# Altium schematic sheet DAC.SchDoc
size A3
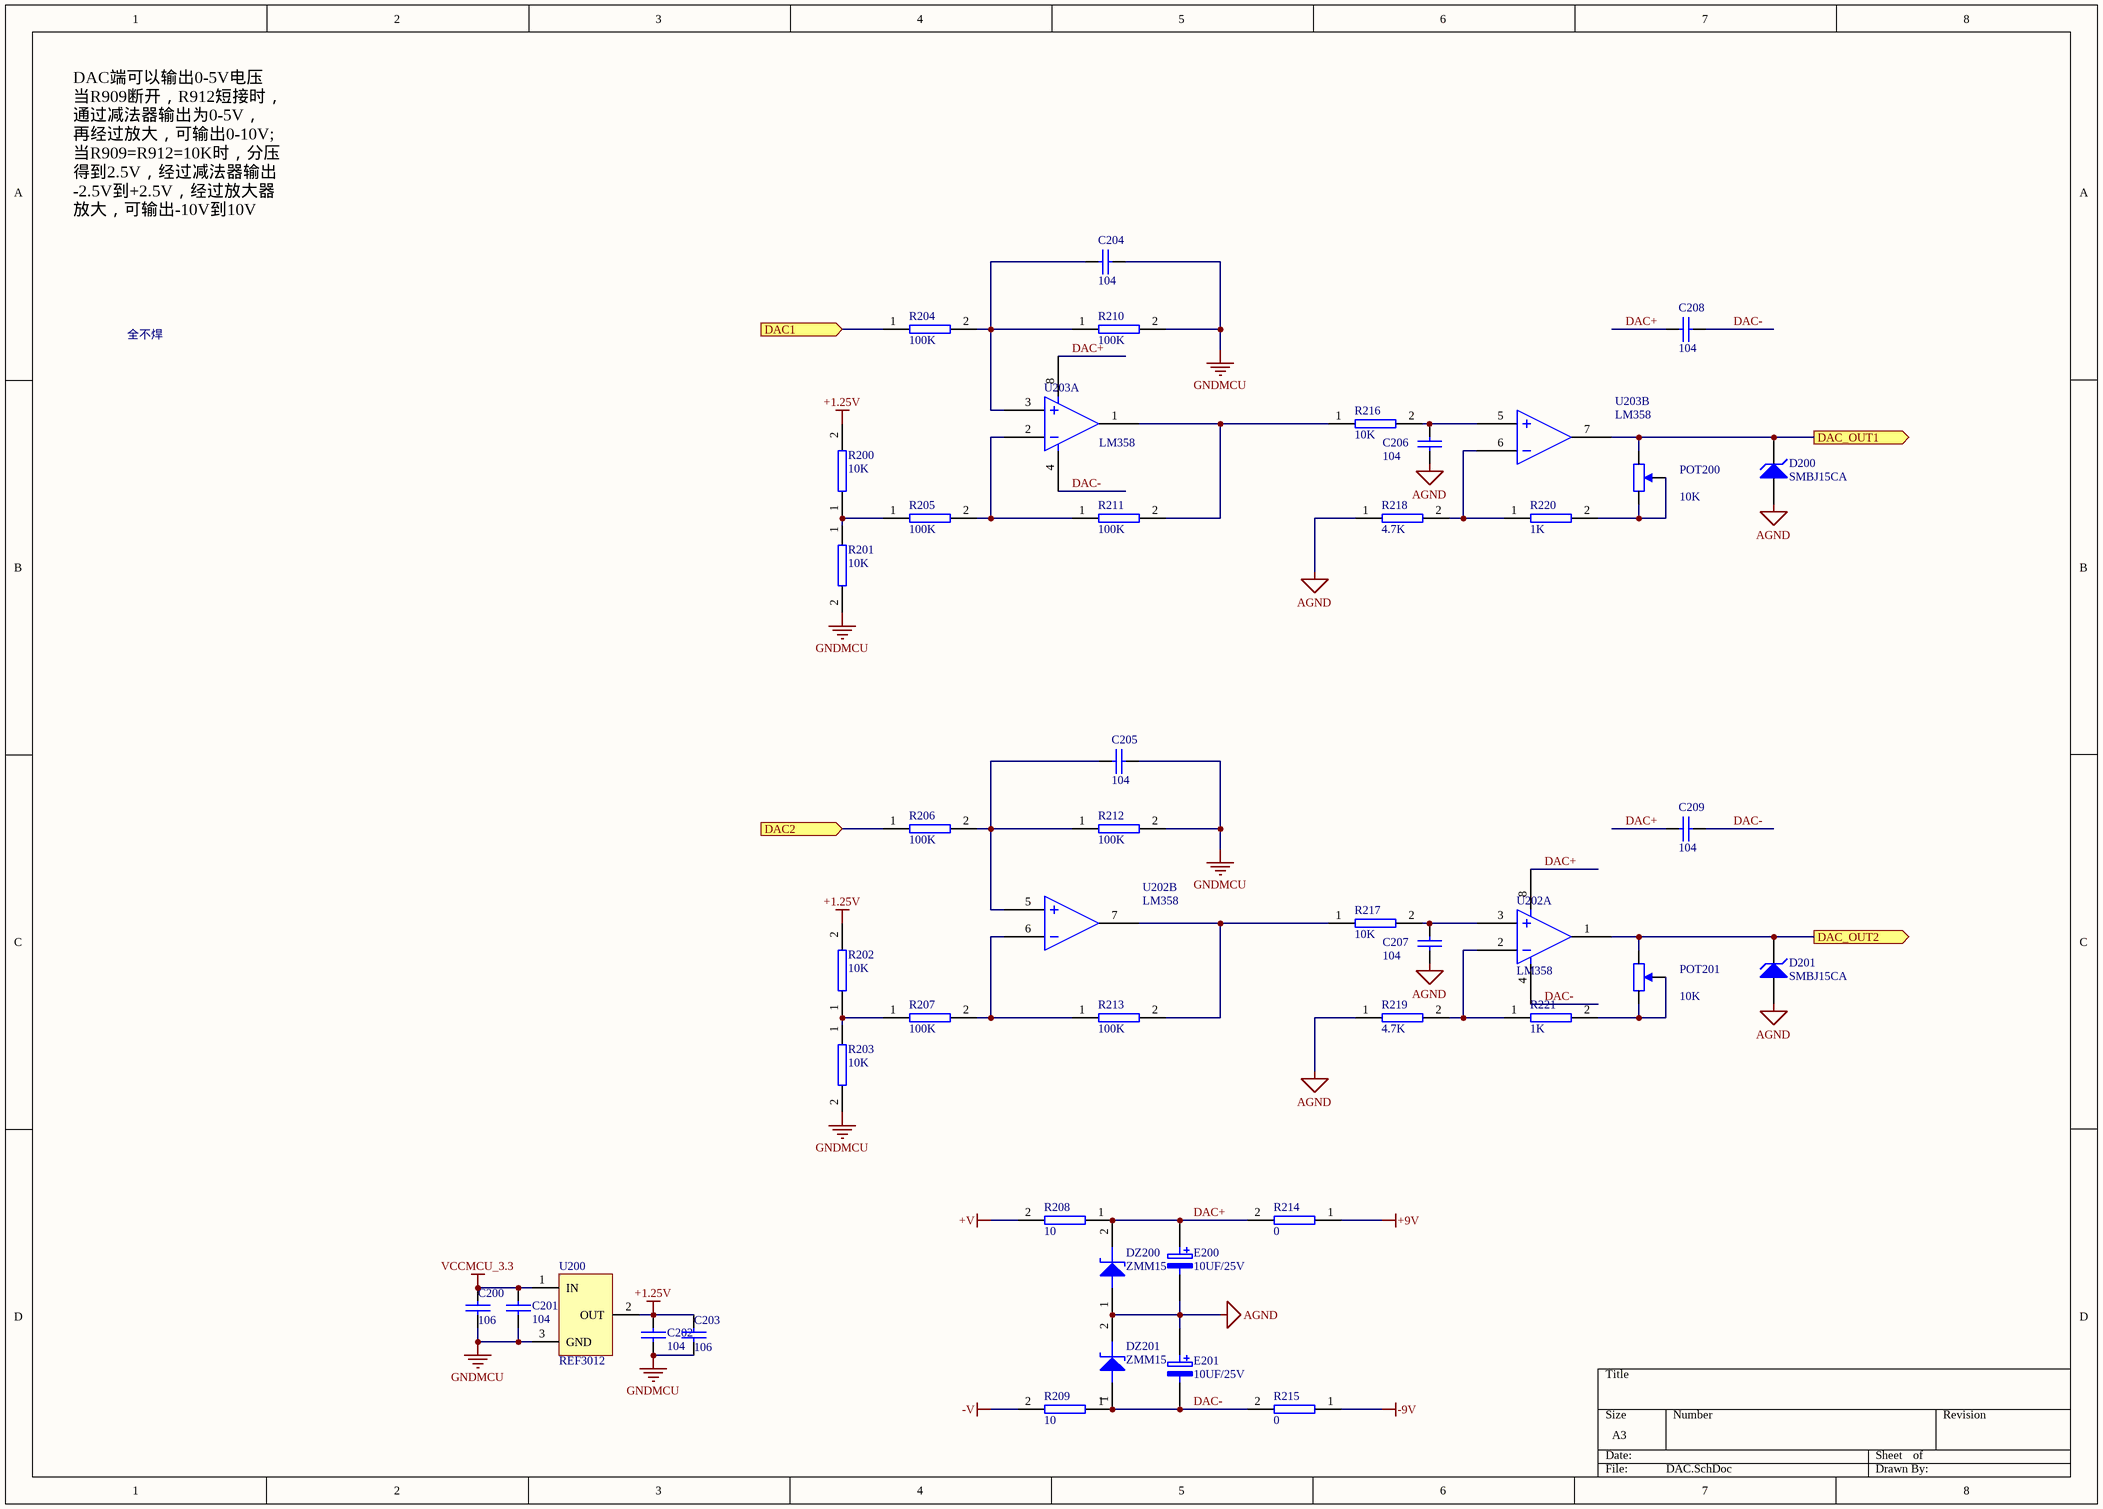
[diagram p0: DAC.SchDoc]

## Parts
C200  106  [0805/C2]
C201  104  [0805/C2]
C202  104  [0805/C2]
C203  106  [0805/C2]
C204  104  [0805/C2]
C205  104  [0805/C2]
C206  104  [0805/C2]
C207  104  [0805/C2]
C208  104  [0805/C2]
C209  104  [0805/C2]
D200  SMBJ15CA  [SMB]
D201  SMBJ15CA  [SMB]
DZ200  ZMM15  [N4148]
DZ201  ZMM15  [N4148]
E200  10UF/25V  [C-10UF]
E201  10UF/25V  [C-10UF]
POT200  10K  [RPOT-3296W]
POT201  10K  [rpOT-3296W]
R200  10K  [RESC_E0805_2012X50N]
R201  10K  [RESC_E0805_2012X50N]
R202  10K  [RESC_E0805_2012X50N]
R203  10K  [RESC_E0805_2012X50N]
R204  100K  [RESC_E0805_2012X50N]
R205  100K  [RESC_E0805_2012X50N]
R206  100K  [RESC_E0805_2012X50N]
R207  100K  [RESC_E0805_2012X50N]
R208  10  [RESC_E0805_2012X50N]
R209  10  [RESC_E0805_2012X50N]
R210  100K  [RESC_E0805_2012X50N]
R211  100K  [RESC_E0805_2012X50N]
R212  100K  [RESC_E0805_2012X50N]
R213  100K  [RESC_E0805_2012X50N]
R214  0  [RESC_E0805_2012X50N]
R215  0  [RESC_E0805_2012X50N]
R216  10K  [RESC_E0805_2012X50N]
R217  10K  [RESC_E0805_2012X50N]
R218  4.7K  [RESC_E0805_2012X50N]
R219  4.7K  [RESC_E0805_2012X50N]
R220  1K  [RESC_E0805_2012X50N]
R221  1K  [RESC_E0805_2012X50N]
U200  REF3012  [SOT-23]
U202  LM358  [sO-8]  (parts A,B of 2)
U203  LM358  [so-8]  (parts A,B of 2)

## Ports
DAC1 (in), DAC2 (in), DAC_OUT1 (out), DAC_OUT2 (out)

## Nets
+1.25V: C202.1 C203.2 R200.2 R202.2 U200.2(OUT)
+9V: R214.1
+V: R208.2
-9V: R215.1
-V: R209.2
AGND: C206.1 C207.1 D200.1(A) D201.1(A) DZ200.1 DZ201.2 E200.2 E201.1 R218.1 R219.1
GNDMCU: C200.1 C201.2 C202.2 C203.1 C204.2 C205.2 R201.2 R203.2 R210.2 R212.2 U200.3(GND)
VCCMCU_3.3: C200.2 C201.1 U200.1(IN)
DAC1: R204.1 ; port DAC1
DAC2: R206.1 ; port DAC2
DAC+: C208.1 C209.1 DZ200.2 E200.1 R208.1 R214.2 U202.8 U203.8
DAC-: C208.2 C209.2 DZ201.1 E201.2 R209.1 R215.2 U202.4 U203.4
DAC_OUT1: D200.2(K) POT200.1 U203.7 ; port DAC_OUT1
DAC_OUT2: D201.2(K) POT201.1 U202.1 ; port DAC_OUT2
NetC204_1: C204.1 R204.2 R210.1 U203.3
NetC205_1: C205.1 R206.2 R212.1 U202.5
NetC206_2: C206.2 R216.2 U203.5
NetC207_2: C207.2 R217.2 U202.3
NetPOT200_2: POT200.2 POT200.3 R220.2
NetPOT201_2: POT201.2 POT201.3 R221.2
NetR200_1: R200.1 R201.1 R205.1
NetR202_1: R202.1 R203.1 R207.1
NetR205_2: R205.2 R211.1 U203.2
NetR207_2: R207.2 R213.1 U202.6
NetR211_2: R211.2 R216.1 U203.1
NetR213_2: R213.2 R217.1 U202.7
NetR218_2: R218.2 R220.1 U203.6
NetR219_2: R219.2 R221.1 U202.2

## Notes on the sheet
- DAC端可以输出0-5V电压
  当R909断开，R912短接时，
  通过减法器输出为0-5V，
  再经过放大，可输出0-10V;
  当R909=R912=10K时，分压
  得到2.5V，经过减法器输出
  -2.5V到+2.5V，经过放大器
  放大，可输出-10V到10V
- 全不焊

## Library data of the parts
C200-C209 = CAP: Capacitor
D200 D201 = D Zener: Zener Diode; Published: 8-Jun-2000; LatestRevisionDate: 17-Jul-2002; LatestRevisionNote: Re-released for DXP Platform.; PackageReference: DIODE-0.7; Publisher: Altium Limited
DZ200 DZ201 = ZENER2: 15v/0.5W
E200 E201 = ELECTRO2: Electrolytic Capacitor
POT200 POT201 = RPOT2
R200-R221 = RES2
U200 = REF3020: 2.048V ,HIGH OUTPUT CURRENT: 25mA,HIGH ACCURACY: 0.2%
U202 U203 = 1458